# Altium schematic sheet connect.SchDoc
size A4
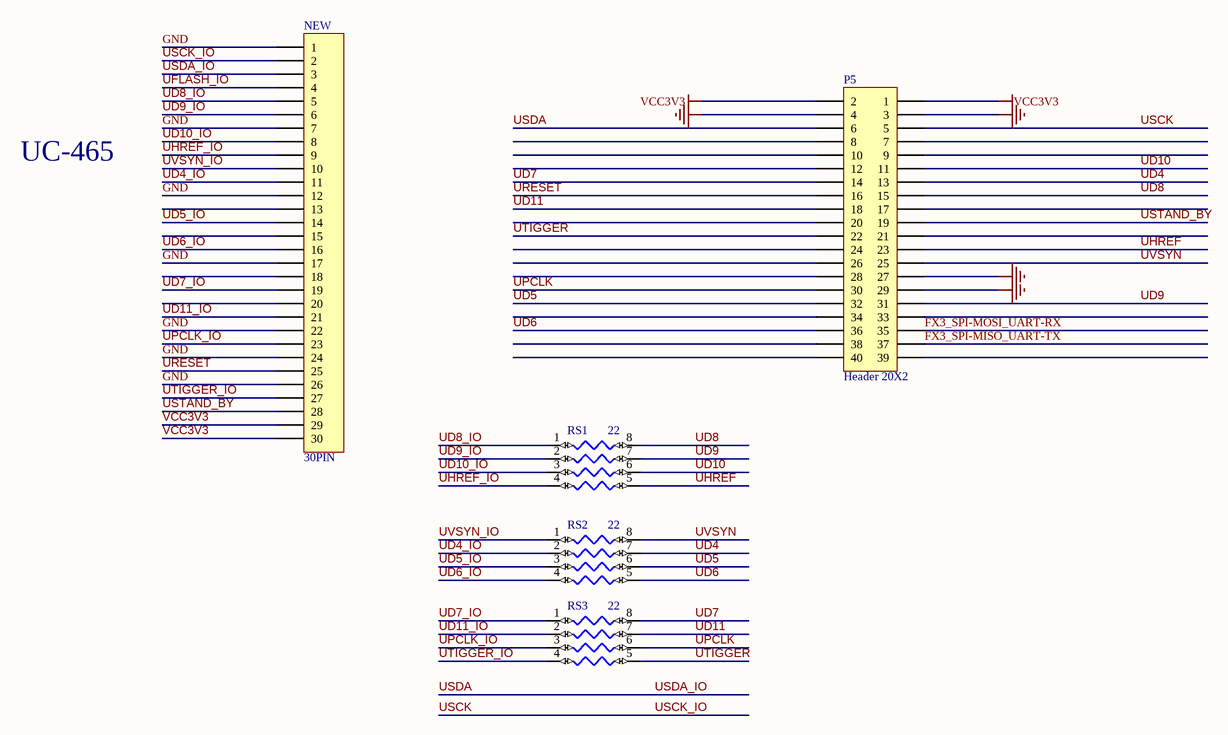
[diagram p0: connect.SchDoc]

## Parts
NEW  30PIN  [FH12-30S-0.5SH]
P5  Header 20X2  [1.27MM 2*20]
RS1  22  [NC06-4]
RS2  22  [NC06-4]
RS3  22  [NC06-4]

## Nets
GND: NEW.1 NEW.7 NEW.12 NEW.17 NEW.22 NEW.24 NEW.26 P5.3 P5.4 P5.27 P5.29
VCC3V3: NEW.29 NEW.30 P5.1 P5.2
FX3_SPI-MISO_UART-TX: P5.37
FX3_SPI-MOSI_UART-RX: P5.35
UD4: P5.13 RS2.7
UD4_IO: NEW.11 RS2.2
UD5: P5.32 RS2.6
UD5_IO: NEW.14 RS2.3
UD6: P5.36 RS2.5
UD6_IO: NEW.16 RS2.4
UD7: P5.14 RS3.8
UD7_IO: NEW.19 RS3.1
UD8: P5.15 RS1.8
UD8_IO: NEW.5 RS1.1
UD9: P5.31 RS1.7
UD9_IO: NEW.6 RS1.2
UD10: P5.11 RS1.6
UD10_IO: NEW.8 RS1.3
UD11: P5.18 RS3.7
UD11_IO: NEW.21 RS3.2
UFLASH_IO: NEW.4
UHREF: P5.23 RS1.5
UHREF_IO: NEW.9 RS1.4
UPCLK: P5.30 RS3.6
UPCLK_IO: NEW.23 RS3.3
URESET: NEW.25 P5.16
USCK: NEW.2 P5.5  [also labelled USCK_IO]
USDA: NEW.3 P5.6  [also labelled USDA_IO]
USTAND_BY: NEW.28 P5.19
UTIGGER: P5.22 RS3.5
UTIGGER_IO: NEW.27 RS3.4
UVSYN: P5.25 RS2.8
UVSYN_IO: NEW.10 RS2.1

Not connected (* = marked no-connect by the designer): NEW 13 15 18 20; P5 7 8 9 10 12 17 20 21 24 26 28 33 34 38 39 40

## Notes on the sheet
- UC-465

## Library data of the parts
NEW = Header 30: Header, 30-Pin; LatestRevisionDate: 17-Jul-2002; LatestRevisionNote: Re-released for DXP Platform.; Publisher: Altium Limited
P5 = Header 20X2: Header, 20-Pin, Dual row; LatestRevisionDate: 17-Jul-2002; LatestRevisionNote: Re-released for DXP Platform.; Publisher: Altium Limited
RS1-RS3 = RN4: Option 2 - Device: *; Option 2 - Spec: *; Option 3 - Device: *; Option 3 - Spec: *; Option 4 - Device: *; Option 4 - Spec: *; Option 5 - Device: *; Option 5 - Spec: *; Option 6 - Device: *; Option 6 - Spec: *; Option 7 - Device: *; Option 7 - Spec: *; Option 8 - Device: *; Option 8 - Spec: *